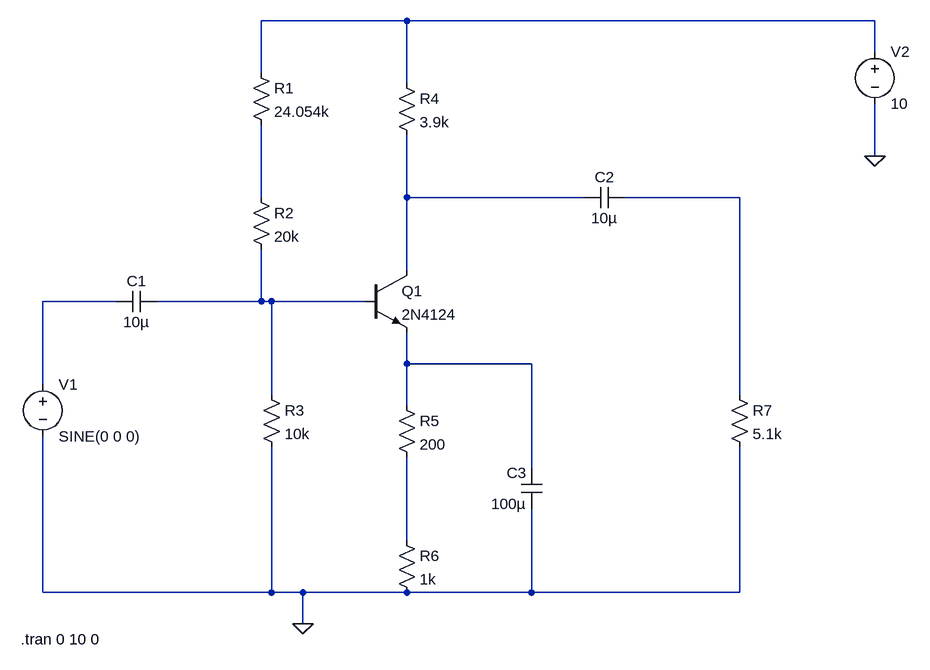
[diagram p0: schematic test1.asc]
test1.asc, the LTspice schematic file:
Version 4
SHEET 1 1016 680
WIRE 240 -400 16 -400
WIRE 960 -400 240 -400
WIRE 960 -352 960 -400
WIRE 16 -320 16 -400
WIRE 240 -304 240 -400
WIRE 960 -192 960 -272
WIRE 16 -128 16 -240
WIRE 240 -128 240 -224
WIRE 512 -128 240 -128
WIRE 752 -128 576 -128
WIRE 240 -16 240 -128
WIRE -208 32 -320 32
WIRE 16 32 16 -48
WIRE 16 32 -144 32
WIRE 32 32 16 32
WIRE 176 32 32 32
WIRE 240 128 240 80
WIRE 432 128 240 128
WIRE -320 160 -320 32
WIRE 32 176 32 32
WIRE 752 176 752 -128
WIRE 240 192 240 128
WIRE 432 288 432 128
WIRE 240 400 240 272
WIRE -320 480 -320 240
WIRE 32 480 32 256
WIRE 32 480 -320 480
WIRE 80 480 32 480
WIRE 240 480 80 480
WIRE 432 480 432 352
WIRE 432 480 240 480
WIRE 752 480 752 256
WIRE 752 480 432 480
WIRE 80 528 80 480
FLAG 80 528 0
FLAG 960 -192 0
SYMBOL npn 176 -16 R0
SYMATTR InstName Q1
SYMATTR Value 2N4124
SYMBOL voltage -320 144 R0
WINDOW 123 0 0 Left 0
WINDOW 39 0 0 Left 0
SYMATTR InstName V1
SYMATTR Value SINE(0 0 0)
SYMBOL cap -144 16 R90
WINDOW 0 0 32 VBottom 2
WINDOW 3 32 32 VTop 2
SYMATTR InstName C1
SYMATTR Value 10µ
SYMBOL cap 576 -144 R90
WINDOW 0 0 32 VBottom 2
WINDOW 3 32 32 VTop 2
SYMATTR InstName C2
SYMATTR Value 10µ
SYMBOL cap 448 352 R180
WINDOW 0 24 56 Left 2
WINDOW 3 24 8 Left 2
SYMATTR InstName C3
SYMATTR Value 100µ
SYMBOL res 0 -336 R0
SYMATTR InstName R1
SYMATTR Value 24.054k
SYMBOL res 0 -144 R0
SYMATTR InstName R2
SYMATTR Value 20k
SYMBOL res 16 160 R0
SYMATTR InstName R3
SYMATTR Value 10k
SYMBOL res 224 -320 R0
SYMATTR InstName R4
SYMATTR Value 3.9k
SYMBOL res 224 176 R0
SYMATTR InstName R5
SYMATTR Value 200
SYMBOL res 224 384 R0
SYMATTR InstName R6
SYMATTR Value 1k
SYMBOL res 736 160 R0
SYMATTR InstName R7
SYMATTR Value 5.1k
SYMBOL voltage 960 -368 R0
WINDOW 123 0 0 Left 0
WINDOW 39 0 0 Left 0
SYMATTR InstName V2
SYMATTR Value 10
TEXT -354 552 Left 2 !.tran 0 10 0

The netlist it stands for:
* test1.asc
Q1 N003 N006 N007 0 2N4124
V1 N005 0 SINE(0 0 0)
C1 N006 N005 10µ
C2 N004 N003 10µ
C3 0 N007 100µ
R1 N001 N002 24.054k
R2 N002 N006 20k
R3 N006 0 10k
R4 N001 N003 3.9k
R5 N007 N008 200
R6 N008 0 1k
R7 N004 0 5.1k
V2 N001 0 10
.model NPN NPN
.model PNP PNP
.lib standard.bjt
.tran 0 10 0
.backanno
.end